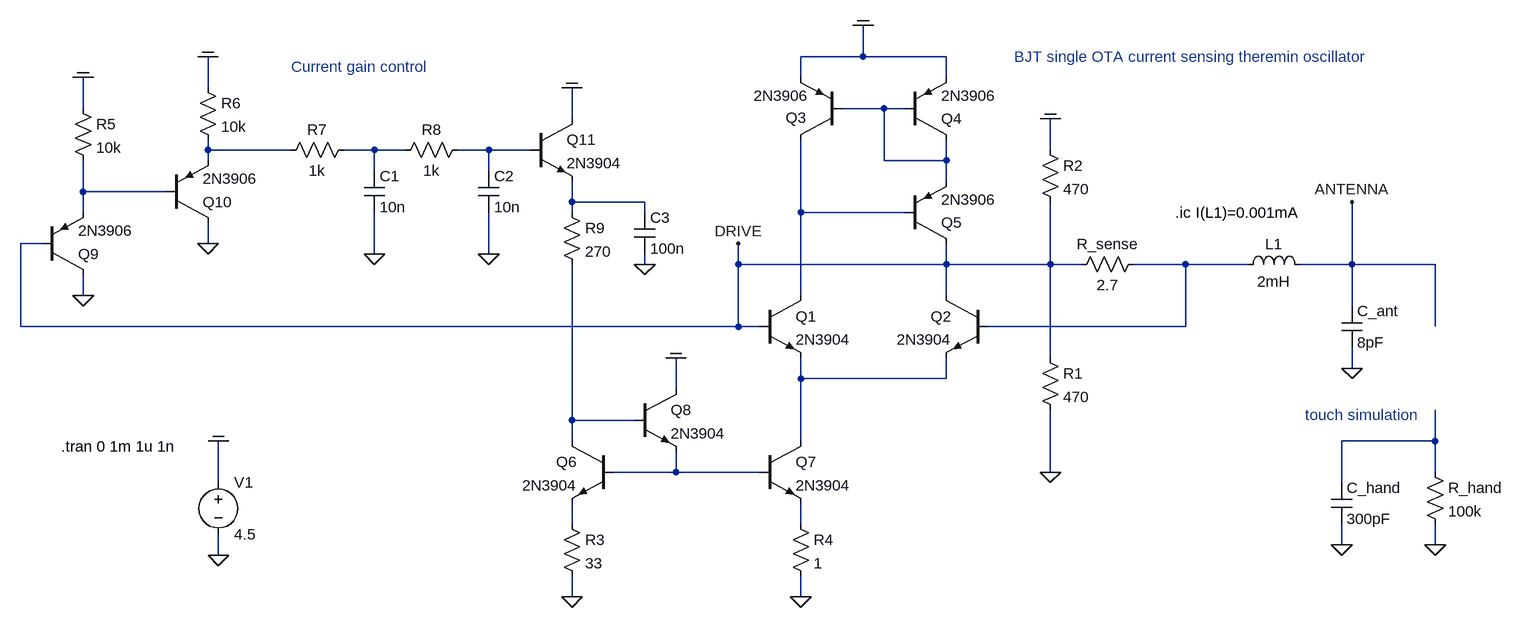
[diagram p0: schematic bjt_current_sensing_oscillator_ota_v2.asc]
bjt_current_sensing_oscillator_ota_v2.asc, the LTspice schematic file:
Version 4
SHEET 1 4500 2052
WIRE 912 -64 912 -112
WIRE 912 -64 816 -64
WIRE 1040 -64 912 -64
WIRE 816 -32 816 -64
WIRE 1040 -32 1040 -64
WIRE -96 -16 -96 -64
WIRE -288 16 -288 -32
WIRE 944 16 880 16
WIRE 976 16 944 16
WIRE 464 32 464 -16
WIRE -96 80 -96 64
WIRE 32 80 -96 80
WIRE 160 80 112 80
WIRE 208 80 160 80
WIRE 336 80 288 80
WIRE 400 80 336 80
WIRE 1200 80 1200 32
WIRE -96 96 -96 80
WIRE 944 96 944 16
WIRE 1040 96 1040 64
WIRE 1040 96 944 96
WIRE 160 112 160 80
WIRE 336 112 336 80
WIRE 1040 128 1040 96
WIRE -288 144 -288 96
WIRE -160 144 -288 144
WIRE 464 160 464 128
WIRE 576 160 464 160
WIRE -288 176 -288 144
WIRE 464 176 464 160
WIRE 576 176 576 160
WIRE 816 176 816 64
WIRE 976 176 816 176
WIRE -352 224 -384 224
WIRE -96 224 -96 192
WIRE 160 240 160 176
WIRE 336 240 336 176
WIRE 576 256 576 240
WIRE 720 256 720 224
WIRE 1040 256 1040 224
WIRE 1040 256 720 256
WIRE 1200 256 1200 160
WIRE 1200 256 1040 256
WIRE 1248 256 1200 256
WIRE 1408 256 1328 256
WIRE 1504 256 1408 256
WIRE 1664 256 1664 160
WIRE 1664 256 1584 256
WIRE 1792 256 1664 256
WIRE -288 304 -288 272
WIRE 816 304 816 176
WIRE 1040 304 1040 256
WIRE 1664 320 1664 256
WIRE -384 352 -384 224
WIRE 720 352 720 256
WIRE 720 352 -384 352
WIRE 752 352 720 352
WIRE 1408 352 1408 256
WIRE 1408 352 1104 352
WIRE 1792 352 1792 256
WIRE 1200 400 1200 256
WIRE 1664 416 1664 384
WIRE 816 432 816 400
WIRE 1040 432 1040 400
WIRE 1040 432 816 432
WIRE 624 448 624 400
WIRE 464 496 464 256
WIRE 560 496 464 496
WIRE 464 528 464 496
WIRE 816 528 816 432
WIRE 1792 528 1792 480
WIRE 1792 528 1648 528
WIRE 624 576 624 544
WIRE 624 576 528 576
WIRE 752 576 624 576
WIRE 1200 576 1200 480
WIRE 1792 576 1792 528
WIRE -80 592 -80 528
WIRE 1648 592 1648 528
WIRE 464 656 464 624
WIRE 816 656 816 624
WIRE 1648 688 1648 656
WIRE 1792 688 1792 656
WIRE -80 704 -80 672
WIRE 464 768 464 736
WIRE 816 768 816 736
FLAG 1664 416 0
FLAG 1664 160 ANTENNA
FLAG 1200 576 0
FLAG -80 704 0
FLAG -80 528 COM
FLAG 912 -112 COM
FLAG -96 -64 COM
FLAG -96 224 0
FLAG 160 240 0
FLAG 336 240 0
FLAG -288 -32 COM
FLAG -288 304 0
FLAG 464 -16 COM
FLAG 464 768 0
FLAG 624 400 COM
FLAG 816 768 0
FLAG 576 256 0
FLAG 1648 688 0
FLAG 1792 688 0
FLAG 1200 32 COM
FLAG 720 224 DRIVE
SYMBOL npn 1104 304 M0
SYMATTR InstName Q2
SYMATTR Value 2N3904
SYMBOL npn 752 304 R0
SYMATTR InstName Q1
SYMATTR Value 2N3904
SYMBOL pnp 976 64 M180
SYMATTR InstName Q4
SYMATTR Value 2N3906
SYMBOL pnp 880 64 R180
WINDOW 0 55 34 Left 2
WINDOW 3 52 68 Left 2
SYMATTR InstName Q3
SYMATTR Value 2N3906
SYMBOL ind 1488 272 R270
WINDOW 0 32 56 VTop 2
WINDOW 3 5 56 VBottom 2
SYMATTR InstName L1
SYMATTR Value 2mH
SYMATTR SpiceLine Ipk=100m Rser=20 Rpar=10Meg Cpar=1pF
SYMBOL cap 1648 320 R0
SYMATTR InstName C_ant
SYMATTR Value 8pF
SYMBOL res 1344 240 R90
WINDOW 0 0 56 VBottom 2
WINDOW 3 32 56 VTop 2
SYMATTR InstName R_sense
SYMATTR Value 2.7
SYMBOL res 1184 384 R0
WINDOW 0 36 40 Left 2
WINDOW 3 36 76 Left 2
SYMATTR InstName R1
SYMATTR Value 470
SYMBOL voltage -80 576 R0
WINDOW 123 0 0 Left 0
WINDOW 39 0 0 Left 0
SYMATTR InstName V1
SYMATTR Value 4.5
SYMBOL pnp 976 224 M180
SYMATTR InstName Q5
SYMATTR Value 2N3906
SYMBOL pnp -160 192 M180
SYMATTR InstName Q10
SYMATTR Value 2N3906
SYMBOL res -112 -32 R0
WINDOW 0 36 40 Left 2
WINDOW 3 36 76 Left 2
SYMATTR InstName R6
SYMATTR Value 10k
SYMBOL cap 144 112 R0
SYMATTR InstName C1
SYMATTR Value 10n
SYMBOL res 128 64 R90
WINDOW 0 0 56 VBottom 2
WINDOW 3 32 56 VTop 2
SYMATTR InstName R7
SYMATTR Value 1k
SYMBOL cap 320 112 R0
SYMATTR InstName C2
SYMATTR Value 10n
SYMBOL res 304 64 R90
WINDOW 0 0 56 VBottom 2
WINDOW 3 32 56 VTop 2
SYMATTR InstName R8
SYMATTR Value 1k
SYMBOL pnp -352 272 M180
SYMATTR InstName Q9
SYMATTR Value 2N3906
SYMBOL res -304 0 R0
WINDOW 0 36 40 Left 2
WINDOW 3 36 76 Left 2
SYMATTR InstName R5
SYMATTR Value 10k
SYMBOL npn 400 32 R0
SYMATTR InstName Q11
SYMATTR Value 2N3904
SYMBOL npn 528 528 M0
SYMATTR InstName Q6
SYMATTR Value 2N3904
SYMBOL res 448 640 R0
WINDOW 0 36 40 Left 2
WINDOW 3 36 76 Left 2
SYMATTR InstName R3
SYMATTR Value 33
SYMBOL npn 560 448 R0
SYMATTR InstName Q8
SYMATTR Value 2N3904
SYMBOL npn 752 528 R0
SYMATTR InstName Q7
SYMATTR Value 2N3904
SYMBOL res 800 640 R0
WINDOW 0 36 40 Left 2
WINDOW 3 36 76 Left 2
SYMATTR InstName R4
SYMATTR Value 1
SYMBOL res 448 160 R0
WINDOW 0 36 40 Left 2
WINDOW 3 36 76 Left 2
SYMATTR InstName R9
SYMATTR Value 270
SYMBOL cap 560 176 R0
SYMATTR InstName C3
SYMATTR Value 100n
SYMBOL cap 1632 592 R0
SYMATTR InstName C_hand
SYMATTR Value 300pF
SYMBOL res 1776 560 R0
WINDOW 0 36 40 Left 2
WINDOW 3 36 76 Left 2
SYMATTR InstName R_hand
SYMATTR Value 100k
SYMBOL res 1184 64 R0
WINDOW 0 36 40 Left 2
WINDOW 3 36 76 Left 2
SYMATTR InstName R2
SYMATTR Value 470
TEXT -322 536 Left 2 !.tran 0 1m 1u 1n
TEXT 1392 176 Left 2 !.ic I(L1)=0.001mA
TEXT 1144 -64 Left 2 ;BJT single OTA current sensing theremin oscillator
TEXT 32 -48 Left 2 ;Current gain control
TEXT 1592 488 Left 2 ;touch simulation

The netlist it stands for:
* bjt_current_sensing_oscillator_ota_v2.asc
Q2 DRIVE N008 N009 0 2N3904
Q1 N007 DRIVE N009 0 2N3904
Q4 N001 N001 COM 0 2N3906
Q3 N007 N001 COM 0 2N3906
L1 N008 ANTENNA 2mH Ipk=100m Rser=20 Rpar=10Meg Cpar=1pF
C_ant ANTENNA 0 8pF
R_sense N008 DRIVE 2.7
R1 DRIVE 0 470
V1 COM 0 4.5
Q5 DRIVE N007 N001 0 2N3906
Q10 0 N005 N002 0 2N3906
R6 COM N002 10k
C1 N003 0 10n
R7 N003 N002 1k
C2 N004 0 10n
R8 N004 N003 1k
Q9 0 DRIVE N005 0 2N3906
R5 COM N005 10k
Q11 COM N004 N006 0 2N3904
Q6 N010 N012 N013 0 2N3904
R3 N013 0 33
Q8 COM N010 N012 0 2N3904
Q7 N009 N012 N014 0 2N3904
R4 N014 0 1
R9 N006 N010 270
C3 N006 0 100n
C_hand N011 0 300pF
R_hand N011 0 100k
R2 COM DRIVE 470
.model NPN NPN
.model PNP PNP
.lib standard.bjt
.tran 0 1m 1u 1n
.ic I(L1)=0.001mA
* BJT single OTA current sensing theremin oscillator
* Current gain control
* touch simulation
.backanno
.end